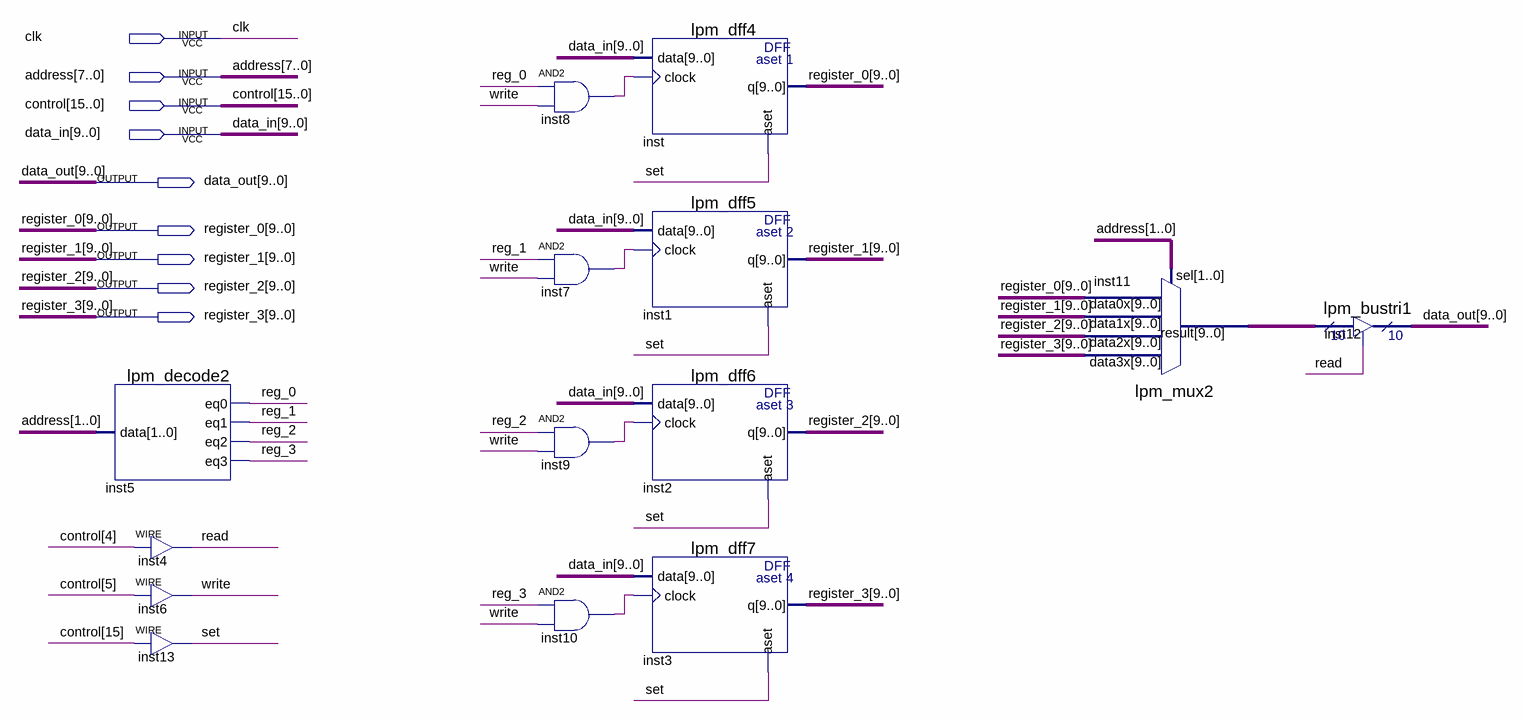
[diagram p0: schematic sheet]
// Quartus schematic RON.bdf as structural Verilog: 14 symbols, 9 pins
module RON (
  input  clk,
  input  [7:0] address,
  input  [15:0] control,
  input  [9:0] data_in,
  output [9:0] data_out,
  output [9:0] register_0,
  output [9:0] register_1,
  output [9:0] register_2,
  output [9:0] register_3
);

  wire inst7_out, inst8_out, inst9_out, inst10_out, read, reg_0, reg_1, reg_2, reg_3, set, write;
  wire [9:0] inst11_result;

  lpm_decode2 inst5 (.data(address[1:0]), .eq0(reg_0), .eq1(reg_1), .eq2(reg_2), .eq3(reg_3));
  assign read = control[4];  // WIRE inst4
  assign write = control[5];  // WIRE inst6
  assign set = control[15];  // WIRE inst13
  and inst8 (inst8_out, reg_0, write);
  and inst7 (inst7_out, reg_1, write);
  and inst9 (inst9_out, reg_2, write);
  and inst10 (inst10_out, reg_3, write);
  lpm_dff4 inst (.data(data_in), .clock(inst8_out), .aset(set), .q(register_0));
  lpm_dff5 inst1 (.data(data_in), .clock(inst7_out), .aset(set), .q(register_1));
  lpm_dff6 inst2 (.data(data_in), .clock(inst9_out), .aset(set), .q(register_2));
  lpm_dff7 inst3 (.data(data_in), .clock(inst10_out), .aset(set), .q(register_3));
  lpm_mux2 inst11 (
    .data3x(register_3), .data2x(register_2), .data1x(register_1), .data0x(register_0), .sel(address[1:0]),
    .result(inst11_result));
  lpm_bustri1 inst12 (.enabledt(read), .data(inst11_result), .tridata(data_out));
endmodule
